# Altium schematic sheet H_Bridge.SchDoc
size Letter
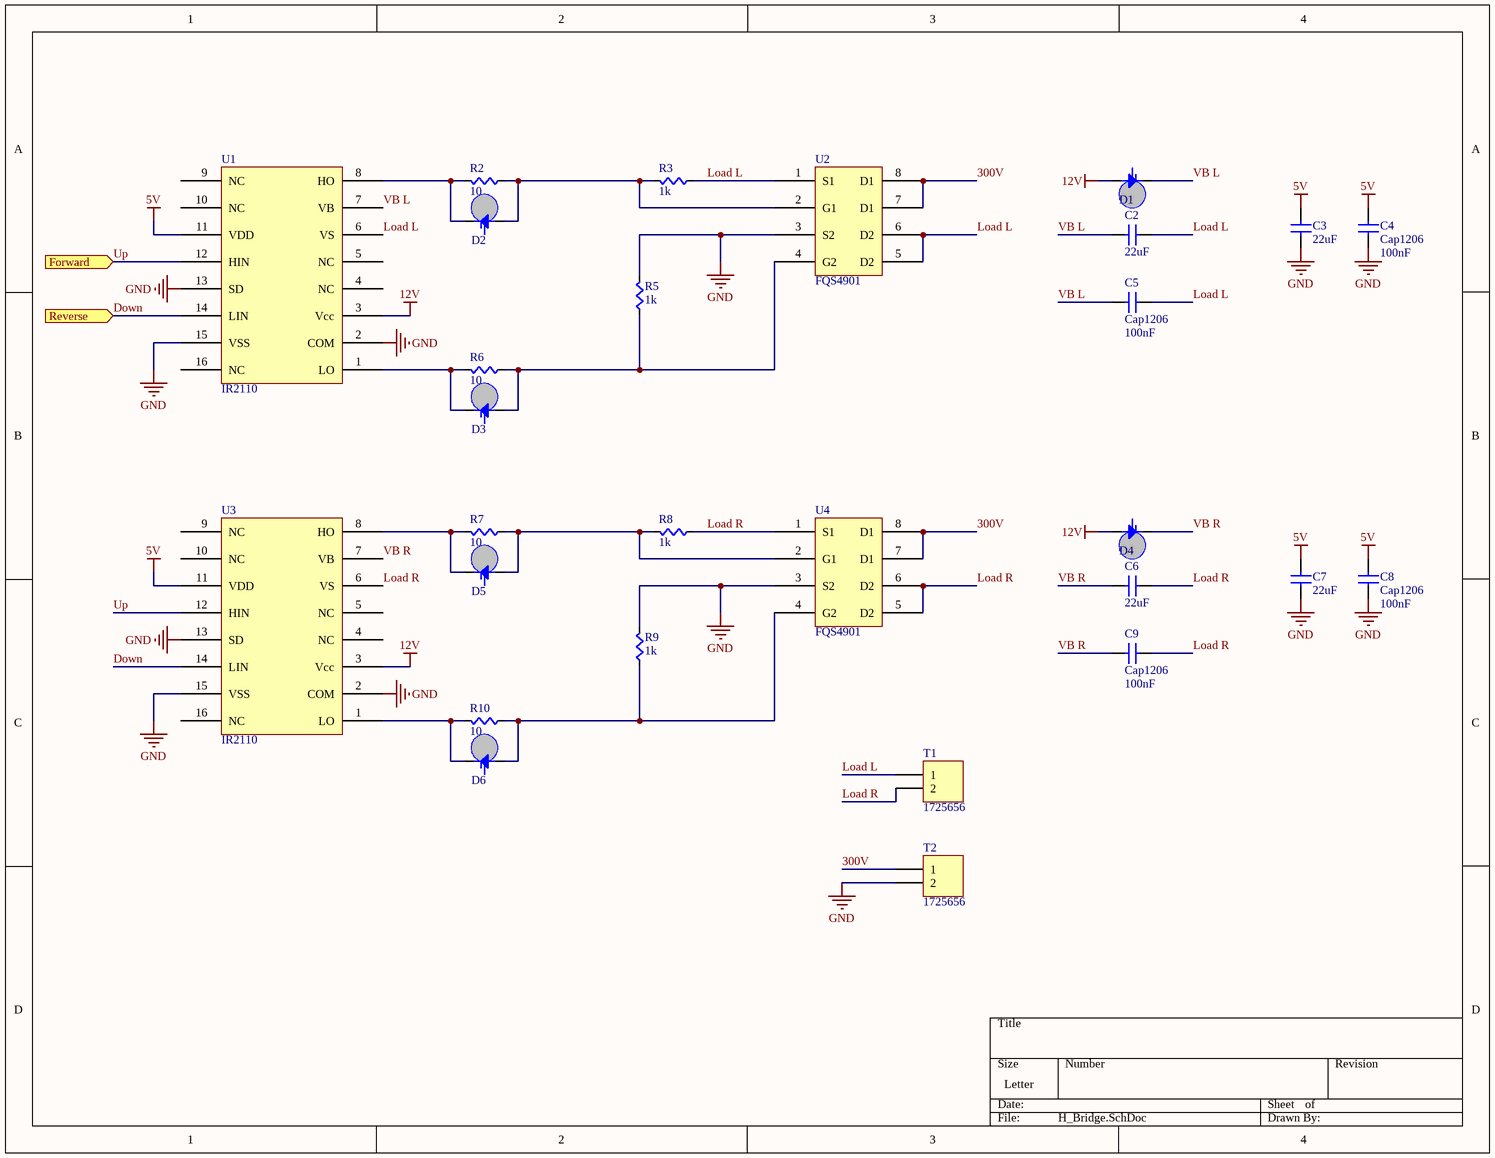
[diagram p0: H_Bridge.SchDoc]

## Parts
C2  value 22uF  [CAPC0603]  (hidden comment: Cap)
C3  value 22uF  [CAPC0603]  (hidden comment: Cap)
C4  Cap1206  value 100nF  [CAP1206]
C5  Cap1206  value 100nF  [CAP1206]
C6  value 22uF  [CAPC0603]  (hidden comment: Cap)
C7  value 22uF  [CAPC0603]  (hidden comment: Cap)
C8  Cap1206  value 100nF  [CAP1206]
C9  Cap1206  value 100nF  [CAP1206]
D1  Diode  [TEMD5510FX01]  (value not drawn)
D2  Diode  [TEMD5510FX01]  (value not drawn)
D3  Diode  [TEMD5510FX01]  (value not drawn)
D4  Diode  [TEMD5510FX01]  (value not drawn)
D5  Diode  [TEMD5510FX01]  (value not drawn)
D6  Diode  [TEMD5510FX01]  (value not drawn)
R2  value 10  [RES0603]  (hidden comment: Res)
R3  value 1k  [RES0603]  (hidden comment: Res)
R5  value 1k  [RES0603]  (hidden comment: Res)
R6  value 10  [RES0603]  (hidden comment: Res)
R7  value 10  [RES0603]  (hidden comment: Res)
R8  value 1k  [RES0603]  (hidden comment: Res)
R9  value 1k  [RES0603]  (hidden comment: Res)
R10  value 10  [RES0603]  (hidden comment: Res)
T1  1725656  [1725656]
T2  1725656  [1725656]
U1  IR2110  [IR2110]
U2  FQS4901  [FQS4901]
U3  IR2110  [IR2110]
U4  FQS4901  [FQS4901]

## Ports
Forward (in), Reverse (in)

## Nets
5V: C3.2(B) C4.2(B) C7.2(B) C8.2(B) U1.11(VDD) U3.11(VDD)
12V: D1.A D4.A U1.3(Vcc) U3.3(Vcc)
GND: C3.1(A) C4.1(A) C7.1(A) C8.1(A) R5.1(A) R9.1(A) T2.2 U1.2(COM) U1.13(SD) U1.15(VSS) U2.3(S2) U3.2(COM) U3.13(SD) U3.15(VSS) U4.3(S2)
300V: T2.1 U2.7(D1) U2.8(D1) U4.7(D1) U4.8(D1)
Down: U1.14(LIN) U3.14(LIN) ; port Reverse
Load L: C2.1(A) C5.1(A) R3.2(B) T1.1 U1.6(VS) U2.1(S1) U2.5(D2) U2.6(D2)
Load R: C6.1(A) C9.1(A) R8.2(B) T1.2 U3.6(VS) U4.1(S1) U4.5(D2) U4.6(D2)
Up: U1.12(HIN) U3.12(HIN) ; port Forward
VB L: C2.2(B) C5.2(B) D1.C U1.7(VB)
VB R: C6.2(B) C9.2(B) D4.C U3.7(VB)
NetD2_A: D2.A R2.2(B) R3.1(A) U2.2(G1)
NetD2_C: D2.C R2.1(A) U1.8(HO)
NetD3_A: D3.A R5.2(B) R6.2(B) U2.4(G2)
NetD3_C: D3.C R6.1(A) U1.1(LO)
NetD5_A: D5.A R7.2(B) R8.1(A) U4.2(G1)
NetD5_C: D5.C R7.1(A) U3.8(HO)
NetD6_A: D6.A R9.2(B) R10.2(B) U4.4(G2)
NetD6_C: D6.C R10.1(A) U3.1(LO)

Not connected (* = marked no-connect by the designer): U1 4(NC) 5(NC) 9(NC) 10(NC) 16(NC); U3 4(NC) 5(NC) 9(NC) 10(NC) 16(NC)

## Library data of the parts
C4 C5 C8 C9 = Cap1206: CAP CER 1UF 50V 10% X7R 1206; Supplier 1: Digi-Key; Supplier Part Number 1: 587-2230-1-ND
D1-D6 = Diode: Standard Diode Template
T1 T2 = 1725656: CONN TERM BLOCK 2.54MM 2POS; Supplier 1: Digi-Key; Supplier Part Number 1: 277-1273-ND
U1 U3 = IR2110: IC DRIVER HIGH/LOW SIDE 16SOIC; Supplier 1: Digi-Key; Supplier Part Number 1: IR2110SPBFCT-ND
U2 U4 = FQS4901: MOSFET 2N-CH 400V 0.45A 8SOP; Supplier 1: Digi-Key; Supplier Part Number 1: FQS4901TFCT-ND
C2 C3 C6 C7 = Cap: Supplier 1: Digi-Key; Supplier Part Number 1: 1276-1000-1-ND
R2 R3 R5-R10 = Res: Supplier 1: Digi-Key; Supplier Part Number 1: RMCF0603JT10K0CT-ND